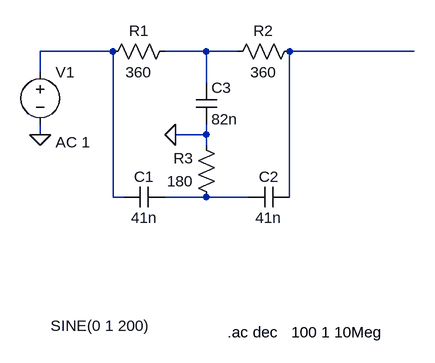
[diagram p0: schematic simulacion.asc]
simulacion.asc, the LTspice schematic file:
Version 4
SHEET 1 880 680
WIRE 96 64 -16 64
WIRE 240 64 176 64
WIRE 288 64 240 64
WIRE 560 64 368 64
WIRE -16 96 -16 64
WIRE 240 112 240 64
WIRE -16 192 -16 176
WIRE 240 192 240 176
WIRE 240 192 192 192
WIRE 240 208 240 192
WIRE 96 288 96 64
WIRE 112 288 96 288
WIRE 240 288 176 288
WIRE 304 288 240 288
WIRE 368 288 368 64
FLAG -16 192 0
FLAG 192 192 0
SYMBOL res 192 48 R90
WINDOW 0 0 56 VBottom 2
WINDOW 3 32 56 VTop 2
SYMATTR InstName R1
SYMATTR Value 360
SYMBOL res 384 48 R90
WINDOW 0 0 56 VBottom 2
WINDOW 3 32 56 VTop 2
SYMATTR InstName R2
SYMATTR Value 360
SYMBOL res 256 304 R180
WINDOW 0 36 76 Left 2
WINDOW 3 36 40 Left 2
SYMATTR InstName R3
SYMATTR Value 180
SYMBOL cap 224 112 R0
SYMATTR InstName C3
SYMATTR Value 82n
SYMBOL cap 368 272 R90
WINDOW 0 0 32 VBottom 2
WINDOW 3 32 32 VTop 2
SYMATTR InstName C2
SYMATTR Value 41n
SYMBOL cap 176 272 R90
WINDOW 0 0 32 VBottom 2
WINDOW 3 32 32 VTop 2
SYMATTR InstName C1
SYMATTR Value 41n
SYMBOL voltage -16 80 R0
WINDOW 123 24 124 Left 2
WINDOW 39 0 0 Left 2
WINDOW 3 16 406 Left 2
SYMATTR Value2 AC 1
SYMATTR InstName V1
SYMATTR Value SINE(0 1 200)
TEXT 272 496 Left 2 !.ac dec   100 1 10Meg

The netlist it stands for:
* simulacion.asc
R1 N002 N001 360
R2 N003 N002 360
R3 N004 0 180
C3 N002 0 82n
C2 N003 N004 41n
C1 N004 N001 41n
V1 N001 0 SINE(0 1 200) AC 1
.ac dec   100 1 10Meg
.backanno
.end